# Altium schematic sheet LCD_Power.SchDoc
size A4; SheetNumber: 2; SheetTotal: 3
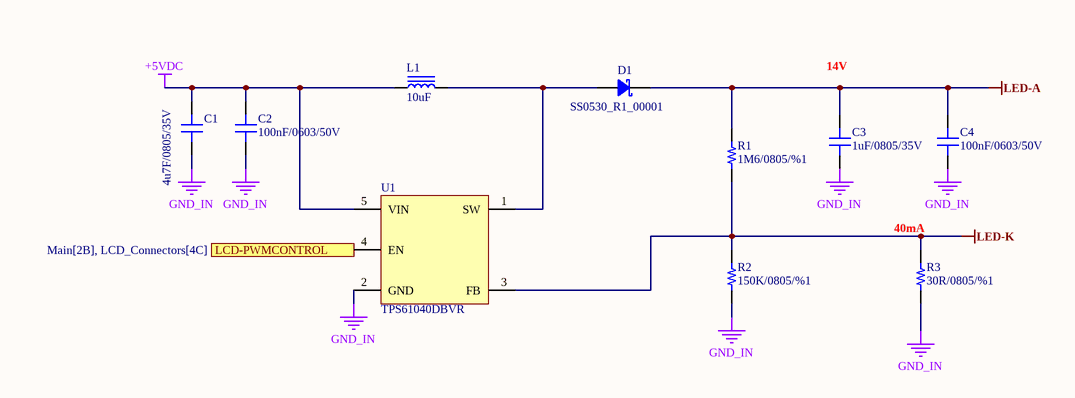
[diagram p0: LCD_Power.SchDoc]

## Parts
C1  4u7F/0805/35V  [0805_cap]
C2  100nF/0603/50V  [0603_cap]
C3  1uF/0805/35V  [0603_cap]
C4  100nF/0603/50V  [0603_cap]
D1  SS0530_R1_00001  [SOD-123]
L1  10uF  [IND(4.5mmX4mm)]
R1  1M6/0805/%1  [0805_res]
R2  150K/0805/%1  [0805_res]
R3  30R/0805/%1  [0805_res]
U1  TPS61040DBVR  [SOT-23-5]

## Ports
LCD-PWMCONTROL (in, see Main[2B], LCD_Connectors[4C])

## Nets
+5VDC: C1.2 C2.2 L1.1 U1.5(VIN)
GND_IN: C1.1 C2.1 C3.1 C4.1 R2.1 R3.1 U1.2(GND)
LED-A: C3.2 C4.2 D1.1 R1.2
LED-K: R1.1 R2.2 R3.2 U1.3(FB)
LCD-PWMCONTROL: U1.4(EN) ; port LCD-PWMCONTROL
NetD1_2: D1.2 L1.2 U1.1(SW)

## Notes on the sheet
- 14V
- (near R3) 40mA

## Library data of the parts
C1-C4 = Capacitor: HelpURL: *; PN: *; Assembly: *
  C1: Value: 4u7F/0805/35V
  C2 C4: Value: 100nF/0603/50V
  C3: Value: 1uF/0805/35V
D1 = SCHOTKY DIODE
L1 = Inductor: CR32NP-100KC
R1-R3 = RES: Assembly: .; HelpURL: *; PN: *
  R1: Value: 1M6/0805/%1
  R2: Value: 150K/0805/%1
  R3: Value: 30R/0805/%1
U1 = TPS61040DBVR: LED Driver IC 1 Output DC DC Regulator Step-Up (Boost) PWM Dimming 350mA (Switch) SOT-23-5; Manufacturer: Texas Instruments; Assembly: .; HelpURL: https://www.digikey.com/en/products/detail/texas-instruments/TPS61040DBVR/454263; Value: TPS61040DBVR